# Altium schematic sheet RF.SchDoc: RF
size A3; DrawnBy: Gad; Revision: 0.1v; SheetNumber: 3; SheetTotal: 3; PageTitle: RF
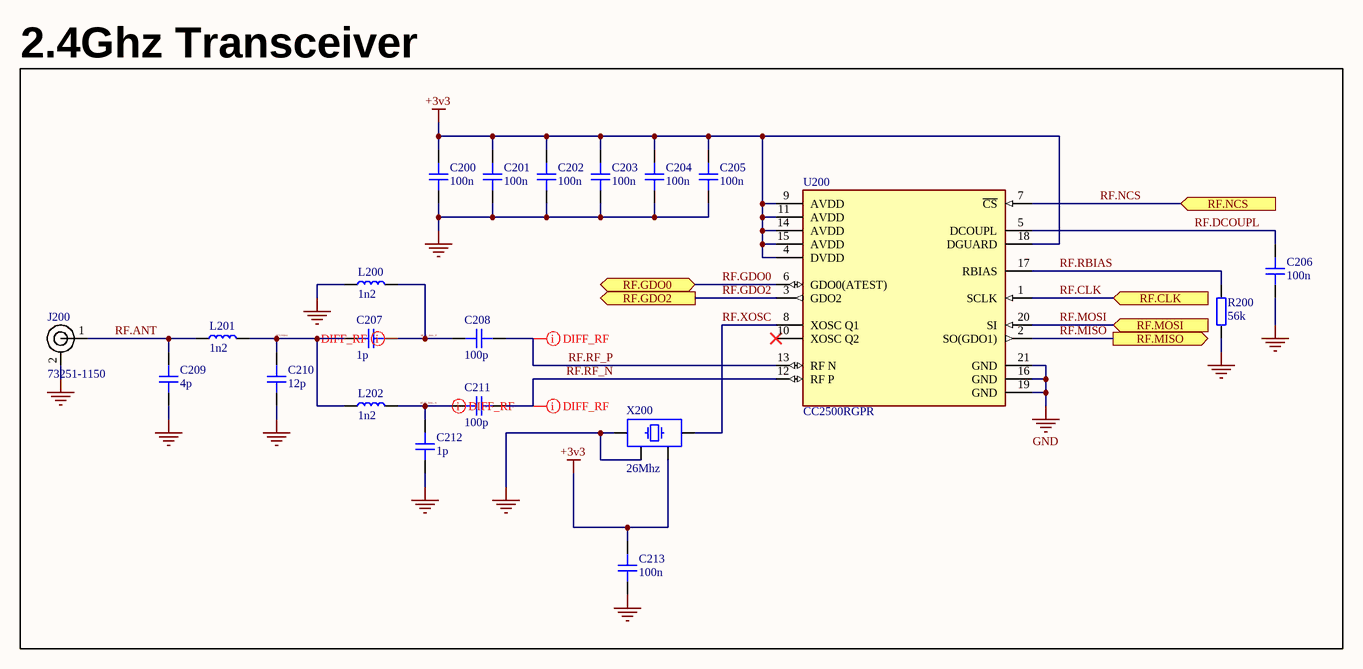
[diagram p0: RF.SchDoc]

## Parts
C200  100n  [CAP_0402]
C201  100n  [CAP_0402]
C202  100n  [CAP_0402]
C203  100n  [CAP_0402]
C204  100n  [CAP_0402]
C205  100n  [CAP_0402]
C206  100n  [CAP_0402]
C207  1p  [CAP_0402]
C208  100p  [CAP_0402]
C209  4p  [CAP_0402]
C210  12p  [CAP_0402]
C211  100p  [CAP_0402]
C212  1p  [CAP_0402]
C213  100n  [CAP_0402]
J200  73251-1150  [73251-1150]
L200  1n2  [IND_0402]
L201  1n2  [IND_0402]
L202  1n2  [IND_0402]
R200  56k  [RES_0402]
U200  CC2500RGPR  [FP-RGP0020C-MFG]
X200  26Mhz  [XTAL_2520]

## Blocks framed on the sheet
2.4Ghz Transceiver: C200-C213 J200 L200-L202 R200 U200 X200

## Ports
RF.CLK (in, see IO[1A]), RF.GDO0 (bidir, see IO[3A]), RF.GDO2 (out, see IO[3A]), RF.MISO (out, see IO[1A]), RF.MOSI (in, see IO[1A]), RF.NCS (in, see IO[1A])

## Nets
+3v3: C200.1 C201.1 C202.1 C203.1 C204.1 C205.1 C213.1 U200.4(DVDD) U200.9(AVDD) U200.11(AVDD) U200.14(AVDD) U200.15(AVDD) U200.18(DGUARD) X200.2
GND: C200.2 C201.2 C202.2 C203.2 C204.2 C205.2 C206.2 C209.2 C210.2 C212.2 C213.2 J200.2 L200.2 R200.1 U200.16(GND) U200.19(GND) U200.21(GND) X200.3 X200.4
RF.ANT: C209.1 J200.1 L201.2
RF.CLK: U200.1(SCLK) ; port RF.CLK
RF.DCOUPL: C206.1 U200.5(DCOUPL)
RF.GDO0: U200.6(GDO0(ATEST)) ; port RF.GDO0
RF.GDO2: U200.3(GDO2) ; port RF.GDO2
RF.MISO: U200.2(SO(GDO1)) ; port RF.MISO
RF.MOSI: U200.20(SI) ; port RF.MOSI
RF.NCS: U200.7(~{CS}) ; port RF.NCS
RF.RBIAS: R200.2 U200.17(RBIAS)
RF.RF_BAL_N: C211.1 C212.1 L202.1
RF.RF_BAL_P: C207.2 C208.1 L200.1
RF.RF_N: C211.2 U200.12(RF_P)
RF.RF_P: C208.2 U200.13(RF_N)
RF.UNBAL: C207.1 C210.1 L201.1 L202.2
RF.XOSC: U200.8(XOSC_Q1) X200.1

Not connected (* = marked no-connect by the designer): U200 10(XOSC_Q2)*

## Layout directives
differential pair; differential pair class DIFF_RF: RF.RF_BAL_N, RF.RF_BAL_P, RF.RF_N, RF.RF_P

## Notes on the sheet
- Title
- Size
- Rev
- Date:
- File:
- A3
- Drawn By:

## Library data of the parts
C200-C205 C213 = CAP_0402: Capacitor SMD 0402 X7R 50V 10% 100nF; Manufacturer: *; Manufacturer Part Number: *; LCSC: *; Dielectric: *; Distributor Link: *; Rating: *
C206 = cap_0402: Capacitor SMD 0402 X7R 50V 10% 100nF; Manufacturer: *; Manufacturer Part Number: *; LCSC: *; Dielectric: *; Distributor Link: *; Rating: *
C207 C212 = CAP_0402: Capacitor SMD 0402 C0G 50V +-0.25pF 1pF; Manufacturer: *; Manufacturer Part Number: *; LCSC: *; Dielectric: *; Distributor Link: *; Rating: *
C208 = CAP_0402: Capacitor SMD 0402 C0G 100V 1% 100pF; Manufacturer: *; Manufacturer Part Number: *; LCSC: *; Dielectric: *; Distributor Link: *; Rating: *
C209 = CAP_0402: Capacitor SMD 0402 C0G 50V +-0.25pF 4pF; Manufacturer: *; Manufacturer Part Number: *; Dielectric: *; Distributor Link: *; LCSC: *; Rating: *
C210 = CAP_0402: Capacitor SMD 0402 C0G 50V 2% 12pF; Manufacturer: *; Manufacturer Part Number: *; LCSC: *; Dielectric: *; Distributor Link: *; Rating: *
C211 = CAP_0402: Capacitor SMD 0402 C0G 100V 1% 100pFCapacitor SMD 0402 C0G 100V 1% 100pF; Manufacturer: *; Manufacturer Part Number: *; LCSC: *; Dielectric: *; Distributor Link: *; Rating: *
J200 = 73251-1150: RF Connector 50 Ohms, SMA Jack Receptacle, Edge Mount, .25µm Gold (Au) Plating; Manufacturer: Molex; Manufacturer Part Number: 73251-1150
L200 L201 = IND_0402: Inductor SMD 0402 RF Unshielded 1.2nH 1A 70mΩ +-0.3nH
L202 = ind_0402: Inductor SMD 0402 RF Unshielded 1.2nH 1A 70mΩ +-0.3nH
R200 = RES_0402: Resistor SMD Thick Film 0402 75V 100mW 1% 56kΩ; Manufacturer: *; Manufacturer Part Number: *; LCSC: *; Distributor Link: *
U200 = CMP-04924-000028-1: IC RF TXRX ISM>1GHZ 20VFQFN; Max Frequency: 2.4835GHz; Number of Transmitters: 1; Min Supply Voltage: 1.8V; Max Supply Voltage: 3.6V; Frequency: 2.4GHz; Interface: SPI; Density: 0B; Data Rate: 500Kbps; Current - Transmitting: 21.5mA; Sensitivity: -104dBm; Current - Receiving: 19.6mA; Mount: Surface Mount; REACH SVHC: No SVHC; Package Quantity: 3000; Packaging: Tape and Reel; Contact Plating: Gold; Max Operating Temperature: 85°C; Length: 4.15mm; Depth: 4.15mm; RoHS Compliant: Yes; Lead Free: Lead Free; Min Operating Temperature: -40°C; Number of Pins: 20; Number of Receivers: 1; Case/Package: VQFN
X200 = XTAL_2520: Crystal SMD 2520; Manufacturer Part Number: OW3EL89CENUNFAYLC-26M; Distributor Link: *